# EAGLE schematic EE319K_Baseline_Schematic (EAGLE 9.6.2)
Fall 2021 EE319K This is the baseline schematic
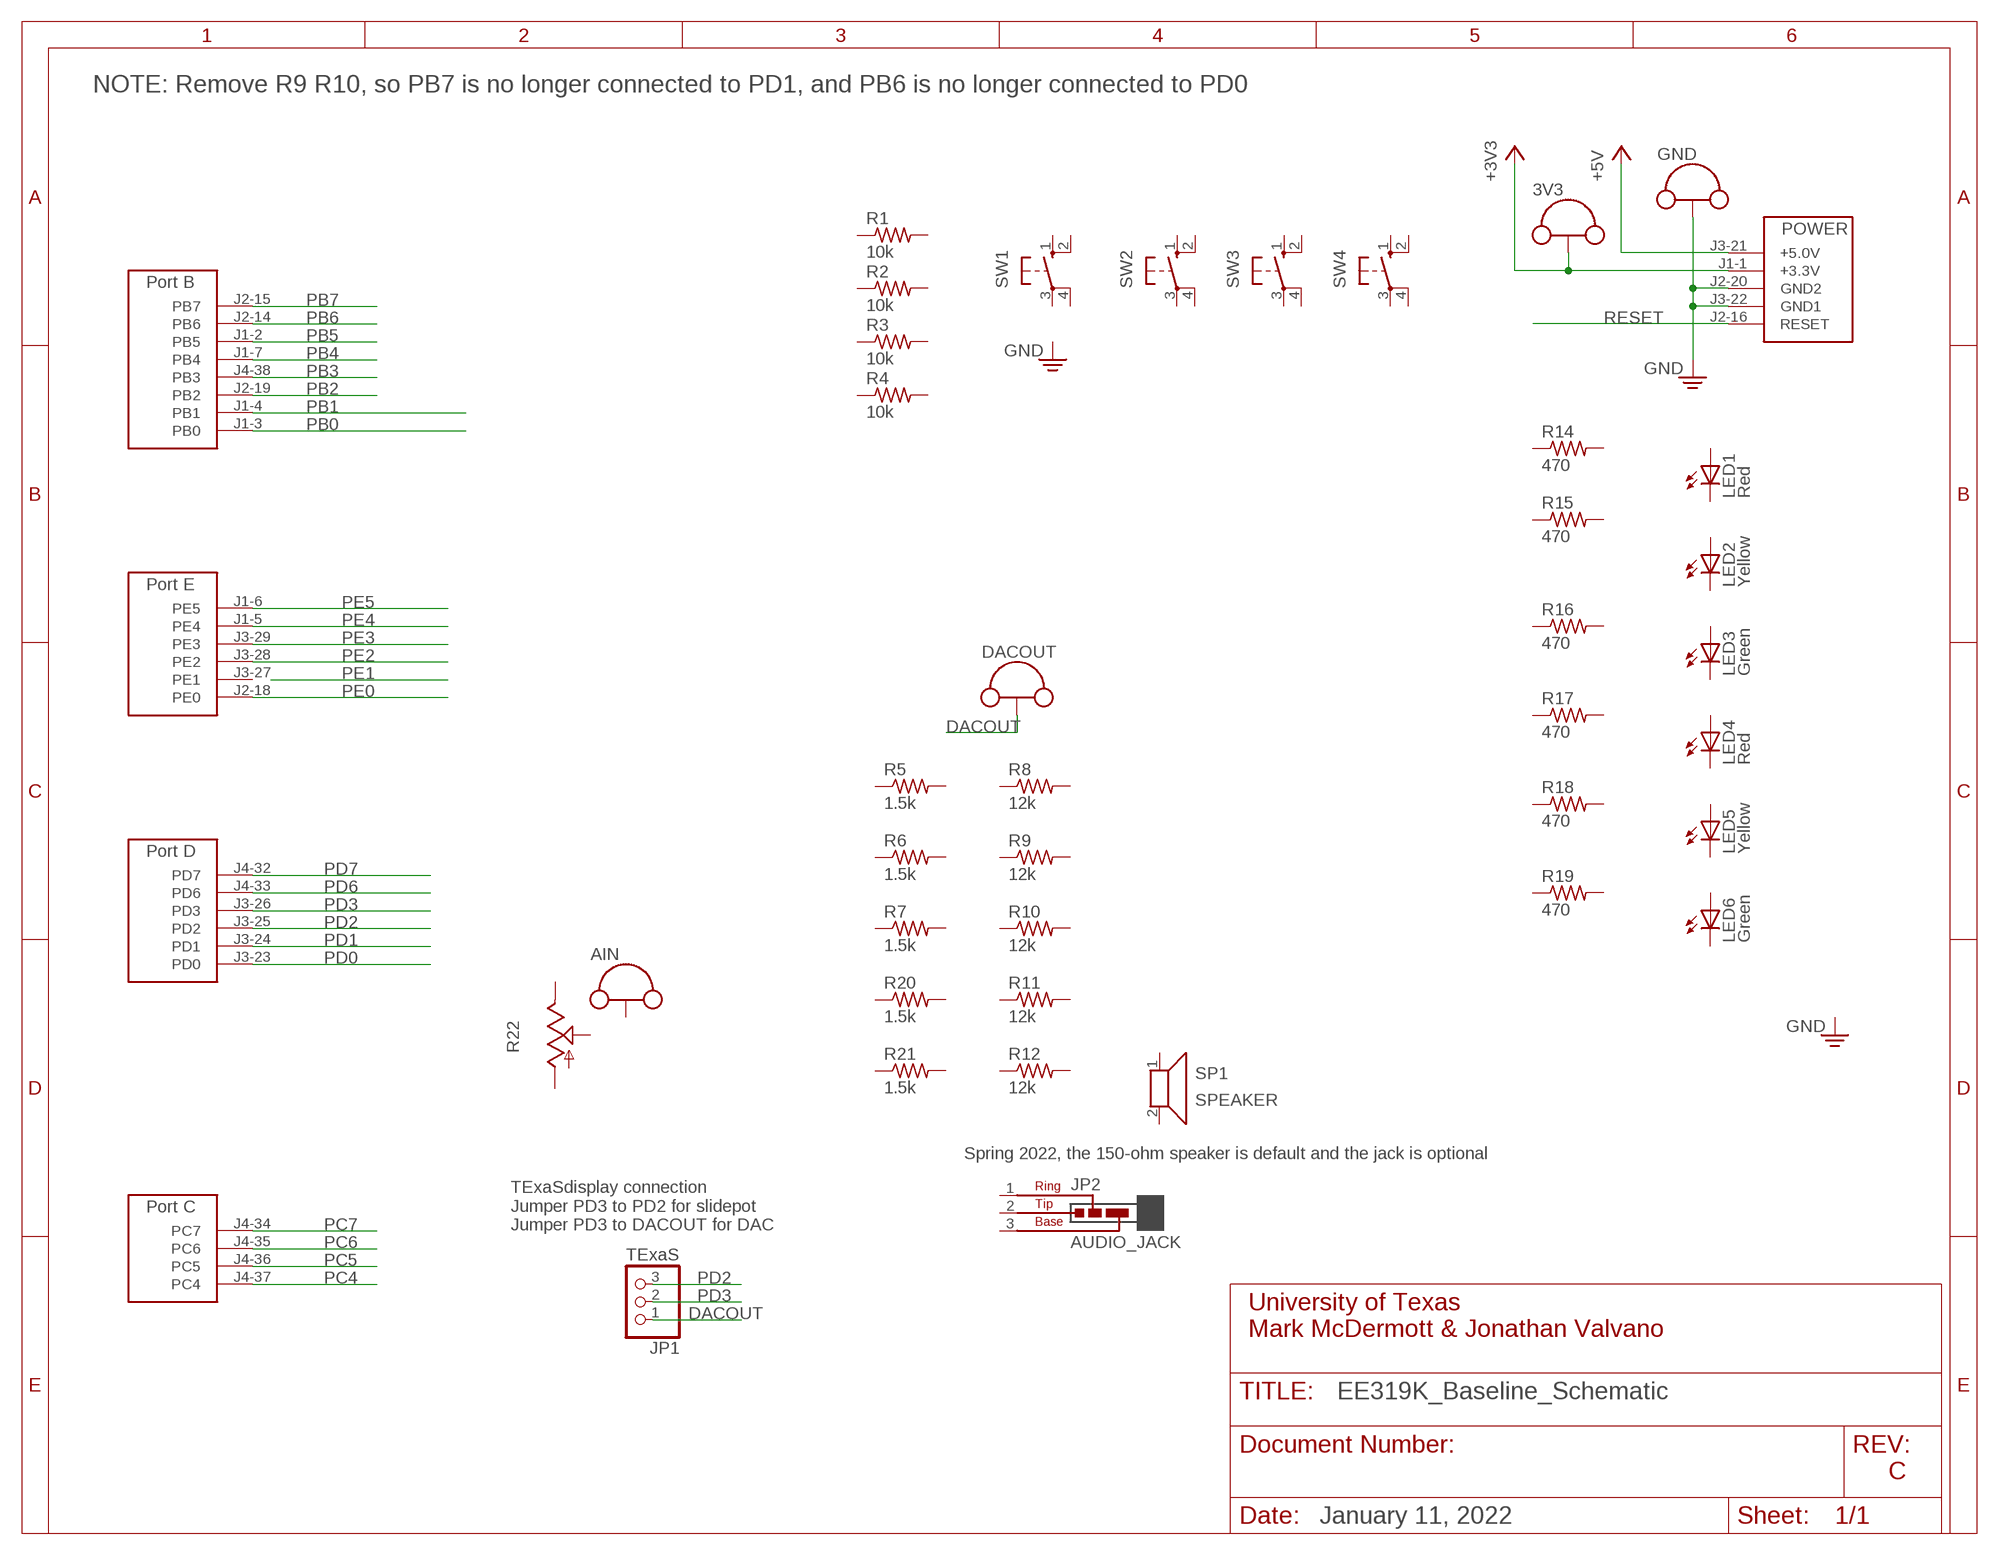
[diagram p0: schematic, sheet 1, part 1 of 2]
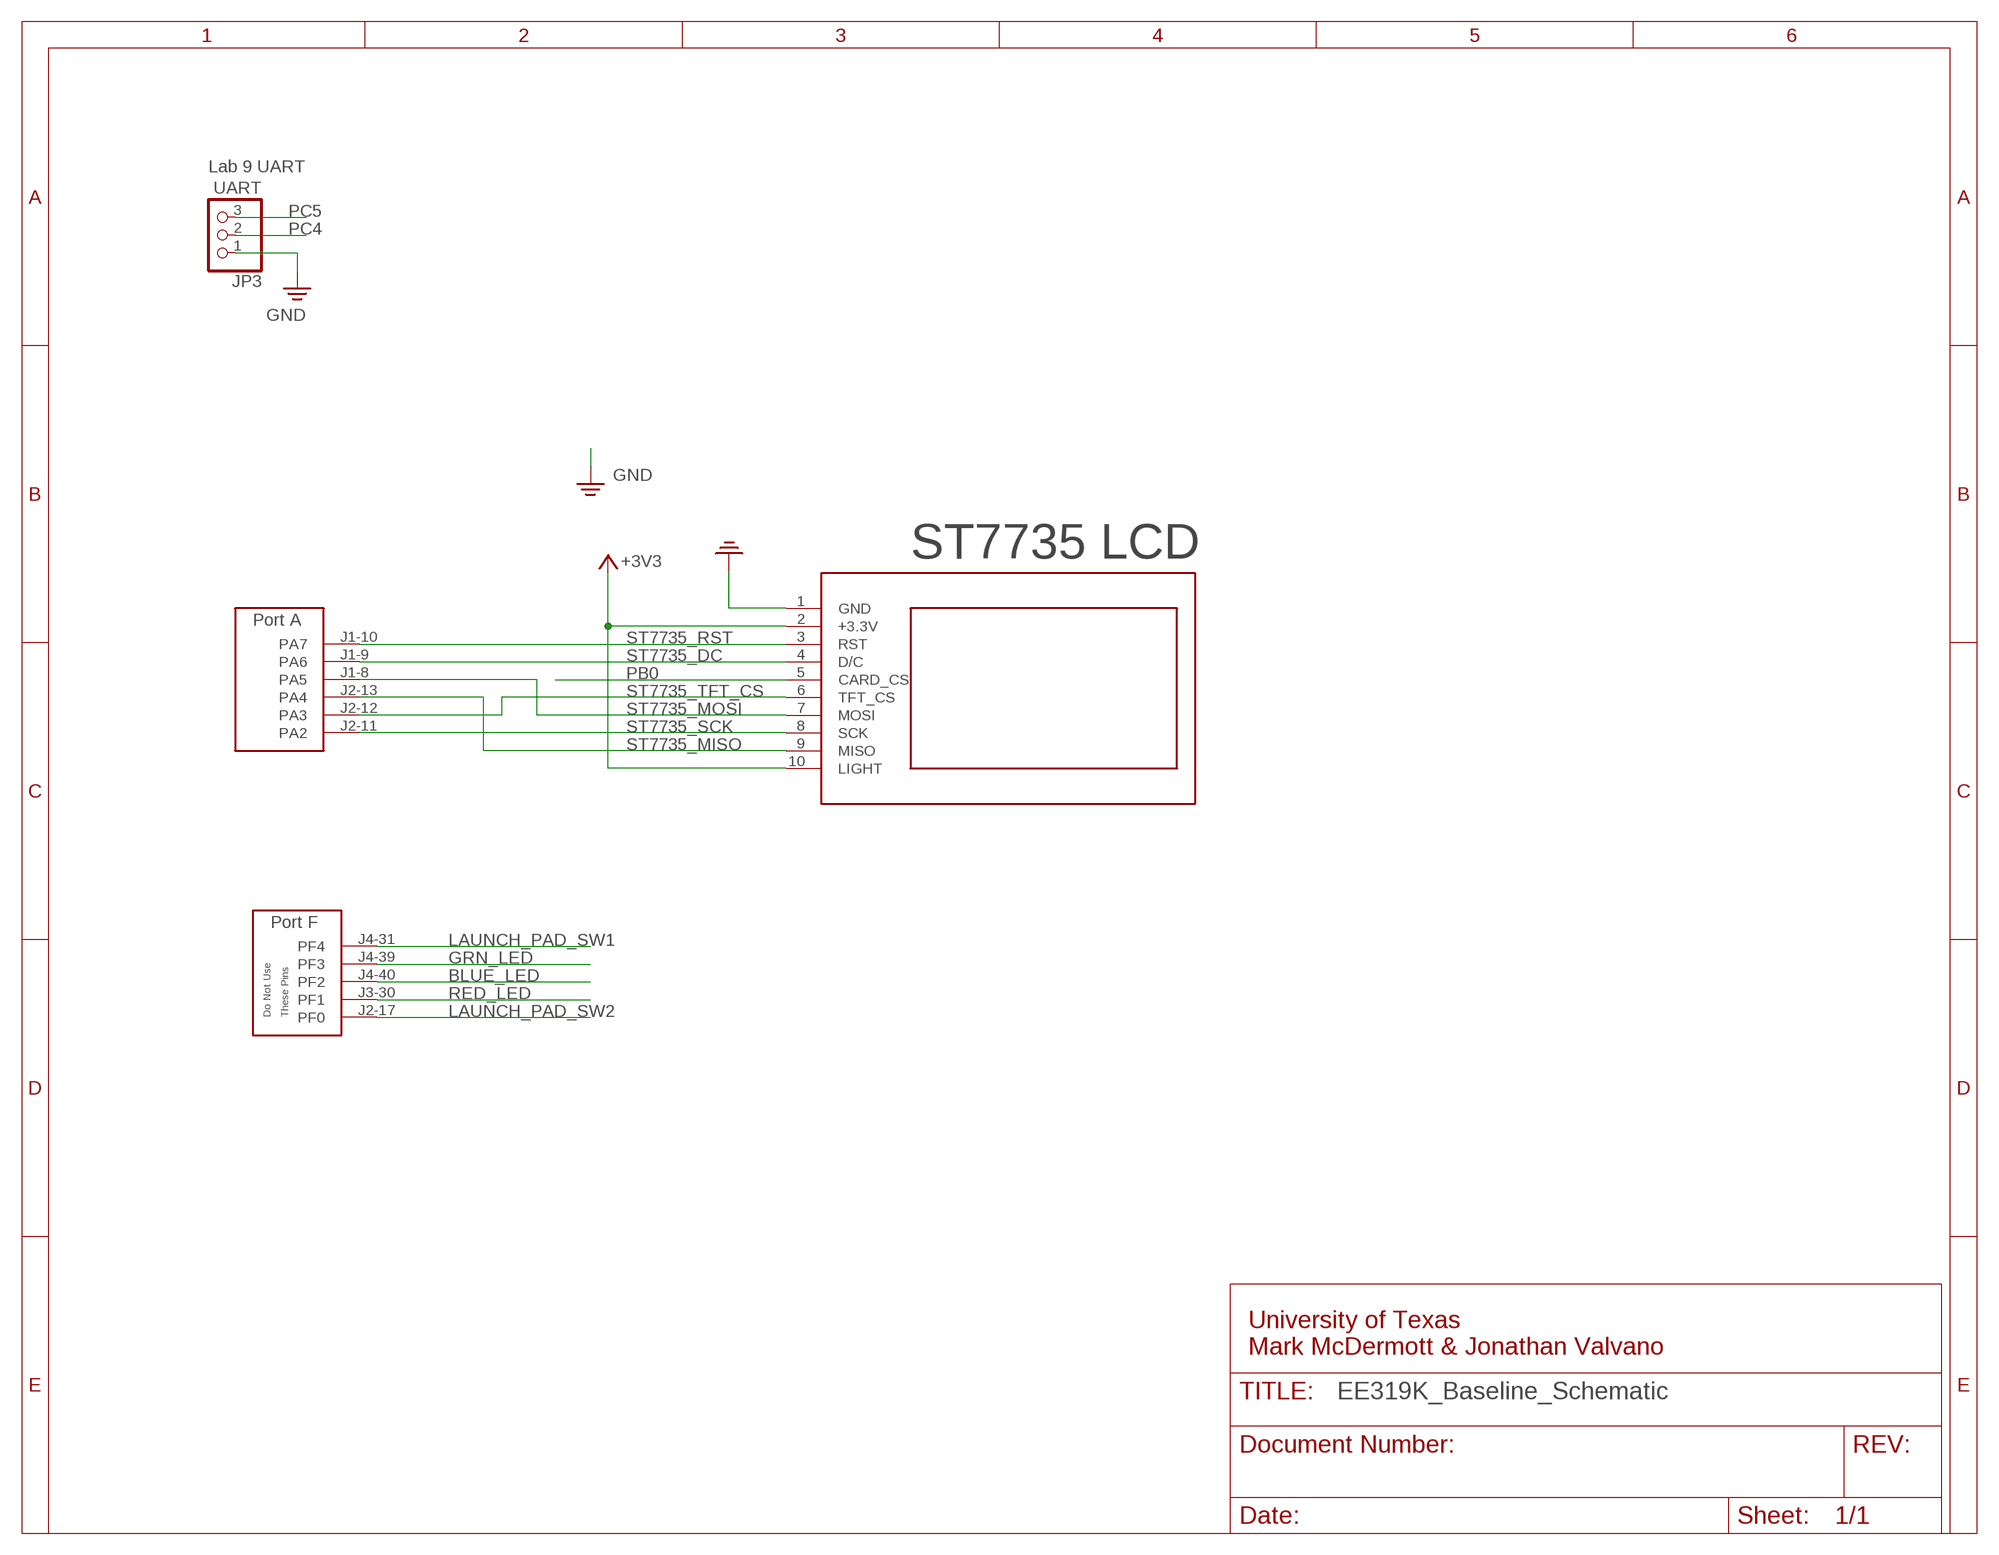
[diagram p1: schematic, sheet 1, part 2 of 2]

## Parts
3V3  TP_LOOP  [TP_LOOP]
AIN  TP_LOOP  [TP_LOOP]
DACOUT  TP_LOOP  [TP_LOOP]
GND  TP_LOOP  [TP_LOOP]
JP1  TExaS  PINHD-1X31X03ROUND  [1X03B]
JP2  AUDIO_JACK  [JACK]
JP3  UART  PINHD-1X3  [1X03]
LED1  Red  LED5MM  [LED5MM]
LED2  Yellow  LED5MM  [LED5MM]
LED3  Green  LED5MM  [LED5MM]
LED4  Red  LED5MM  [LED5MM]
LED5  Yellow  LED5MM  [LED5MM]
LED6  Green  LED5MM  [LED5MM]
R1  10k  RESISTOR0204/7  [RES300MIL]
R2  10k  RESISTOR0204/7  [RES300MIL]
R3  10k  RESISTOR0204/7  [RES300MIL]
R4  10k  RESISTOR0204/7  [RES300MIL]
R5  1.5k  RESISTOR0204/7  [RES300MIL]
R6  1.5k  RESISTOR0204/7  [RES300MIL]
R7  1.5k  RESISTOR0204/7  [RES300MIL]
R8  12k  RESISTOR0204/7  [RES300MIL]
R9  12k  RESISTOR0204/7  [RES300MIL]
R10  12k  RESISTOR0204/7  [RES300MIL]
R11  12k  RESISTOR0204/7  [RES300MIL]
R12  12k  RESISTOR0204/7  [RES300MIL]
R14  470  RESISTOR0204/7  [RES300MIL]
R15  470  RESISTOR0204/7  [RES300MIL]
R16  470  RESISTOR0204/7  [RES300MIL]
R17  470  RESISTOR0204/7  [RES300MIL]
R18  470  RESISTOR0204/7  [RES300MIL]
R19  470  RESISTOR0204/7  [RES300MIL]
R20  1.5k  RESISTOR0204/7  [RES300MIL]
R21  1.5k  RESISTOR0204/7  [RES300MIL]
R22  POTENTIOMETER_PTA2043B25U  [PTA2043]
SP1  SPEAKER  [1X02]
SW1  B3F-1052  [B3F-10XX]
SW2  B3F-1052  [B3F-10XX]
SW3  B3F-1052  [B3F-10XX]
SW4  B3F-1052  [B3F-10XX]
U$2  TM4C_BP  [TM4C_BOOSTER_PACK]
U$3  ST7735  [ST7735]

## Nets
+3V3: 3V3.P$1(TP) 3V3.P$2(TP) U$2.J1-1(+3.3V) U$3.2(+3.3V) U$3.10(LIGHT)
+5V: U$2.J3-21(+5.0V)
BLUE_LED: U$2.J4-40(PF2)
DACOUT: DACOUT.P$1(TP) DACOUT.P$2(TP) JP1.1
GND: GND.P$1(TP) GND.P$2(TP) JP3.1 U$2.J2-20(GND2) U$2.J3-22(GND1) U$3.1(GND)
GRN_LED: U$2.J4-39(PF3)
LAUNCH_PAD_SW1: U$2.J4-31(PF4)
LAUNCH_PAD_SW2: U$2.J2-17(PF0)
PB0: U$2.J1-3(PB0) U$3.5(CARD_CS)
PB1: U$2.J1-4(PB1)
PB2: U$2.J2-19(PB2)
PB3: U$2.J4-38(PB3)
PB4: U$2.J1-7(PB4)
PB5: U$2.J1-2(PB5)
PB6: U$2.J2-14(PB6)
PB7: U$2.J2-15(PB7)
PC4: JP3.2 U$2.J4-37(PC4)
PC5: JP3.3 U$2.J4-36(PC5)
PC6: U$2.J4-35(PC6)
PC7: U$2.J4-34(PC7)
PD0: U$2.J3-23(PD0)
PD1: U$2.J3-24(PD1)
PD2: JP1.3 U$2.J3-25(PD2)
PD3: JP1.2 U$2.J3-26(PD3)
PD6: U$2.J4-33(PD6)
PD7: U$2.J4-32(PD7)
PE0: U$2.J2-18(PE0)
PE2: U$2.J3-28(PE2)
PE3: U$2.J3-29(PE3)
PE4: U$2.J1-5(PE4)
PE5: U$2.J1-6(PE5)
RED_LED: U$2.J3-30(PF1)
RESET: U$2.J2-16(RESET)
ST7735_DC: U$2.J1-9(PA6) U$3.4(D/C)
ST7735_MISO: U$2.J2-13(PA4) U$3.9(MISO)
ST7735_MOSI: U$2.J1-8(PA5) U$3.7(MOSI)
ST7735_RST: U$2.J1-10(PA7) U$3.3(RST)
ST7735_SCK: U$2.J2-11(PA2) U$3.8(SCK)
ST7735_TFT_CS: U$2.J2-12(PA3) U$3.6(TFT_CS)
Unconnected: AIN.P$1(TP) AIN.P$2(TP) JP2.1(RING) JP2.2(TIP) JP2.3(BASE) LED1.A LED1.K(C) LED2.A LED2.K(C) LED3.A LED3.K(C) LED4.A LED4.K(C) LED5.A LED5.K(C) LED6.A LED6.K(C) R1.1 R1.2 R2.1 R2.2 R3.1 R3.2 R4.1 R4.2 R5.1 R5.2 R6.1 R6.2 R7.1 R7.2 R8.1 R8.2 R9.1 R9.2 R10.1 R10.2 R11.1 R11.2 R12.1 R12.2 R14.1 R14.2 R15.1 R15.2 R16.1 R16.2 R17.1 R17.2 R18.1 R18.2 R19.1 R19.2 R20.1 R20.2 R21.1 R21.2 R22.1(E) R22.2(S) R22.3(A) SP1.1 SP1.2 SW1.1(S) SW1.2(S1) SW1.3(P) SW1.4(P1) SW2.1(S) SW2.2(S1) SW2.3(P) SW2.4(P1) SW3.1(S) SW3.2(S1) SW3.3(P) SW3.4(P1) SW4.1(S) SW4.2(S1) SW4.3(P) SW4.4(P1) U$2.J3-27(PE1)

## Notes on the sheet
- NOTE: Remove R9 R10, so PB7 is no longer connected to PD1, and PB6 is no longer connected to PD0
- Lab 9 UART
- ST7735 LCD
- Spring 2022, the 150-ohm speaker is default and the jack is optional
- TExaSdisplay connection
  Jumper PD3 to PD2 for slidepot
  Jumper PD3 to DACOUT for DAC
- University of Texas
  Mark McDermott & Jonathan Valvano
- University of Texas
  Mark McDermott & Jonathan Valvano
- C
- January 11, 2022

## Library data of the parts
3V3 AIN DACOUT GND = EE445L:TP_LOOP
JP1 JP3 = EE445L:PINHD-1X3: PIN HEADER
JP2 = EE445L:AUDIO_JACK: Audio Jack Stereo Jack 3pin 3.5mm, CUI, SJ1-3553NG, CP1-3553NG-ND; OC_FARNELL: unknown; OC_NEWARK: unknown
LED1-LED6 = EE445L:LED: Avago Technologies LED Green 2mA 5mm diffused, HLMP-4740, Digikey 516-1327-ND Red 1.6V 1mA 5mm diffused, HLMP-D150, Digikey 516-1323-ND Yellow 2mA 5mm diffused, HLMP-4719, Digikey 516-1326-ND Orange 10mA 5mm diffused HLMP-D401, Digikey 516-1330-ND Blue 10mA 5mm diffused
R1-R12 R14-R21 = EE445L:RESISTOR: RESISTOR, American symbol
R22 = EE445L:POTENTIOMETER_PTA2043: POTENTIOMETER Warning There are many many sizes and shapes of potentiometers. Please verify both the wiring and the physical layout of your pots.
SP1 = EE445L:SPEAKER: Speaker Connected off PCB with two wires. 32-ohm speaker, AllElectronics, SK-230, http://www.allelectronics.com/make-a-store/item/sk-230/20-mm-32-ohm-speaker/1.html
SW1-SW4 = EE445L:B3F-1052: OMRON SWITCH 1.1mm holes; MPN: B3F-1000; OC_FARNELL: 176432; OC_NEWARK: 36M3542
U$2 = EE445L:TM4C_BP
U$3 = EE445L:ST7735